# Altium schematic sheet Lab11.SchDoc
size Letter; Author: Aaron Huinink; SheetNumber: 1; SheetTotal: 1
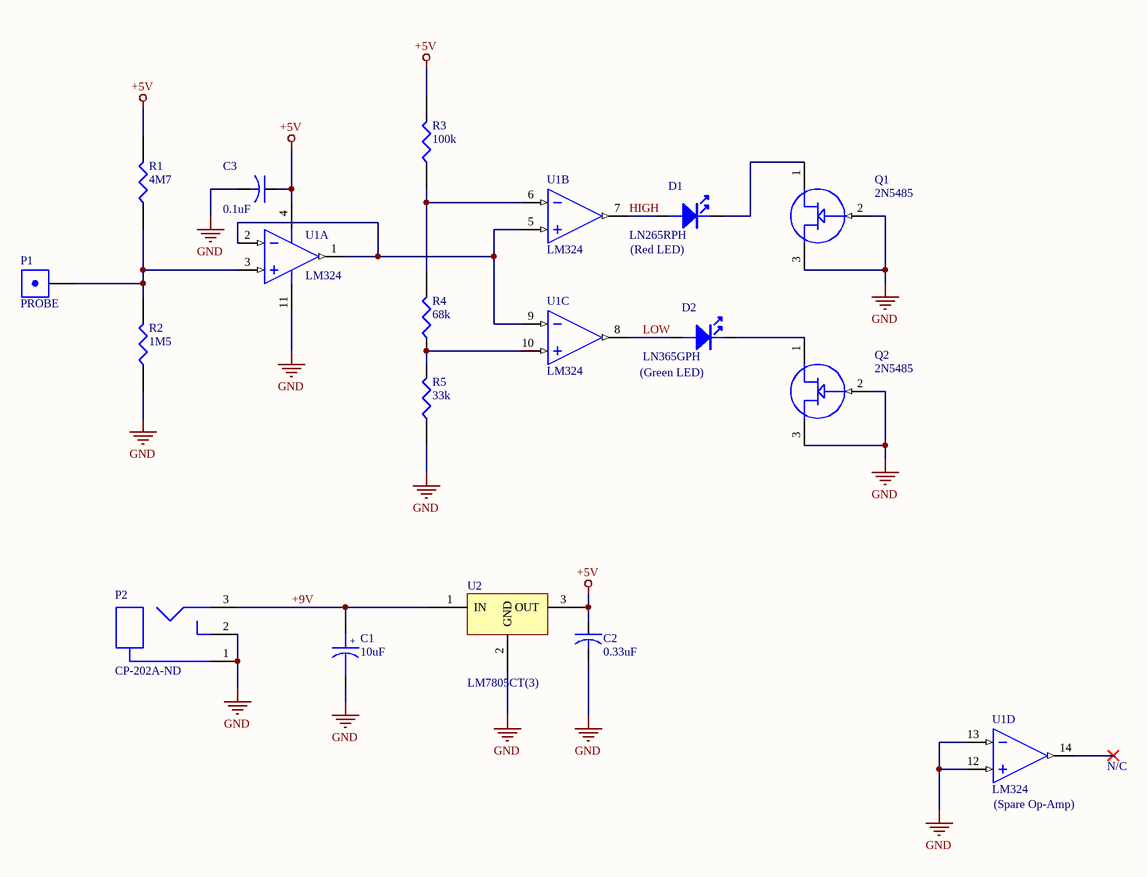
[diagram p0: Lab11.SchDoc]

## Parts
C1  10uF  [RAD0.2-POL]
C2  0.33uF  [RAD0.2]
C3  0.1uF  [RAD0.2]
D1  LN265RPH
D2  LN365GPH
P1  PROBE  [PROBE]
P2  CP-202A-ND
Q1  2N5485  [TO-92A]
Q2  2N5485  [TO-92A]
R1  4M7  [axial0.5]
R2  1M5  [axial0.5]
R3  100k  [axial0.5]
R4  68k  [axial0.5]
R5  33k  [axial0.5]
U1  LM324  [DIP14]  (parts A,B,C,D of 4)
U2  LM7805CT(3)

## Nets
+5V: C2.1 C3.1 R1.2 R3.2 U1.4(VCC) U2.3(OUT)
GND: C1.2 C2.2 C3.2 P2.1 P2.2 Q1.2 Q1.3 Q2.2 Q2.3 R2.1 R5.1 U1.11(VEE) U1.12(4_IN+) U1.13(4_IN-) U2.2(GND)
+9V: C1.1 P2.3 U2.1(IN)
HIGH: D1.A U1.7(2_OUT)
LOW: D2.A U1.8(3_OUT)
NetD1_K: D1.K Q1.1
NetD2_K: D2.K Q2.1
NetP1_1: P1.1 R1.1 R2.2 U1.3(1_IN+)
NetR3_1: R3.1 R4.2 U1.6(2_IN-)
NetR4_1: R4.1 R5.2 U1.10(3_IN+)
NetU1_1: U1.1(1_OUT) U1.2(1_IN-) U1.5(2_IN+) U1.9(3_IN-)

Not connected (* = marked no-connect by the designer): U1 14(4_OUT)*

## Notes on the sheet
- (Red LED)
- (Green LED)
- (near U1) (Spare Op-Amp)
- N/C
- (in symbol CAPACITOR POL) +

## Library data of the parts
C1 = CAPACITOR POL: Polarized Electrolytic Capacitor
C2 C3 = CAPACITOR: Non-polarized Electrolytic Capacitor
D1 D2 = LED: Light Emitting Diode LED
P2 = CP-202A-ND: Male Power Jack, PCB
Q1 Q2 = 2N5485: N-channel JFET
R1-R5 = RES1: Resistor
U1 = LM324: Quad Operational Amplifier
U2 = LM7805CT(3): Three Terminal Voltage Regulator